# Altium schematic sheet MCU.SchDoc
size C; SheetNumber: 2; SheetTotal: 6
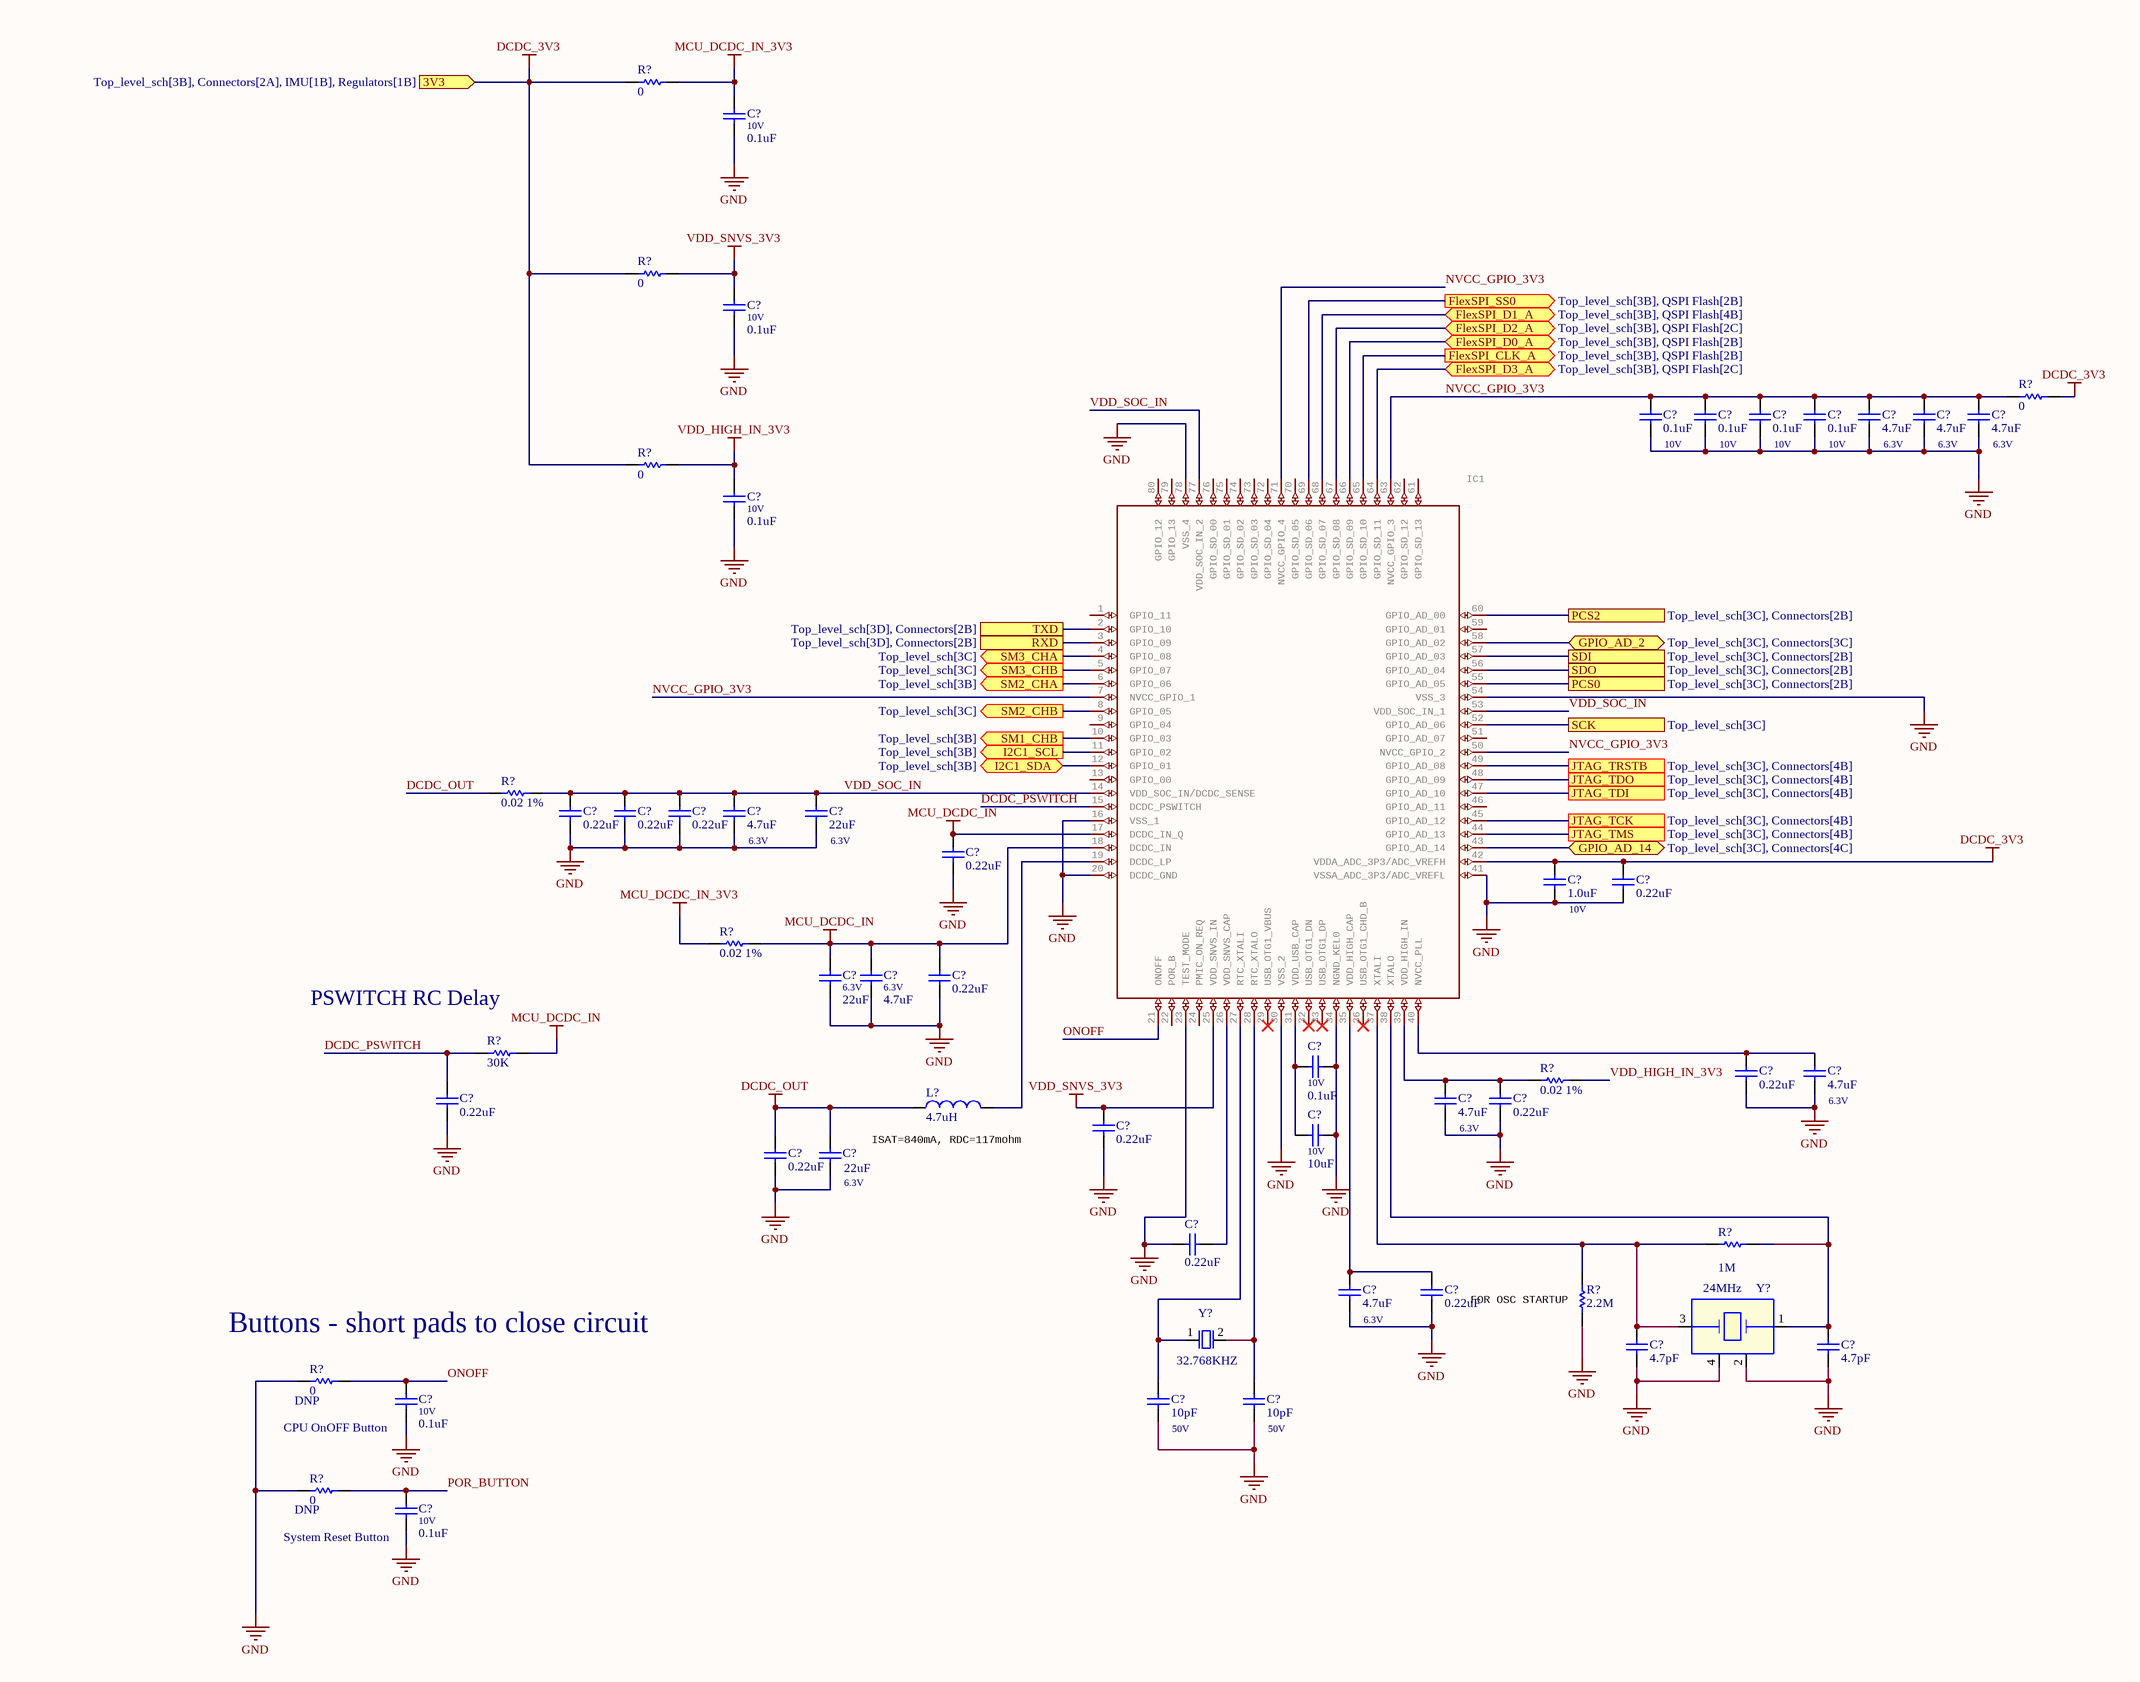
[diagram p0: MCU.SchDoc]

## Parts
(Parts that share a designator on the sheet are numbered #1, #2 ... from top to bottom, then left to right.)
C?#1  value 0.1uF  Voltage: 10V  (hidden comment: Capacitor)
C?#2  value 0.1uF  Voltage: 10V  (hidden comment: Capacitor)
C?#3  value 0.1uF  Voltage: 10V  (hidden comment: Capacitor)
C?#4  value 0.1uF  Voltage: 10V  (hidden comment: Capacitor)
C?#5  value 0.1uF  Voltage: 10V  (hidden comment: Capacitor)
C?#6  value 0.1uF  Voltage: 10V  (hidden comment: Capacitor)
C?#7  value 4.7uF  Voltage: 6.3V  (hidden comment: Capacitor)
C?#8  value 4.7uF  Voltage: 6.3V  (hidden comment: Capacitor)
C?#9  value 4.7uF  Voltage: 6.3V  (hidden comment: Capacitor)
C?#10  value 0.1uF  Voltage: 10V  (hidden comment: Capacitor)
C?#11  OC14: 0.22uF  (hidden comment: Capacitor)
C?#12  OC15: 0.22uF  (hidden comment: Capacitor)
C?#13  OC16: 0.22uF  (hidden comment: Capacitor)
C?#14  value 4.7uF  Voltage: 6.3V  (hidden comment: Capacitor)
C?#15  value 22uF  Voltage: 6.3V  (hidden comment: Capacitor)
C?#16  value 0.22uF  (hidden comment: Capacitor)
C?#17  value 1.0uF  Voltage: 10V  (hidden comment: Capacitor)
C?#18  OC7: 0.22uF  (hidden comment: Capacitor)
C?#19  value 22uF  Voltage: 6.3V  (hidden comment: Capacitor)
C?#20  value 4.7uF  Voltage: 6.3V  (hidden comment: Capacitor)
C?#21  value 0.22uF  (hidden comment: Capacitor)
C?#22  value 0.1uF  Voltage: 10V  (hidden comment: Capacitor)
C?#23  OC25: 0.22uF  (hidden comment: Capacitor)
C?#24  value 4.7uF  Voltage: 6.3V  (hidden comment: Capacitor)
C?#25  value 0.22uF  (hidden comment: Capacitor)
C?#26  value 4.7uF  Voltage: 6.3V  (hidden comment: Capacitor)
C?#27  OC20: 0.22uF  (hidden comment: Capacitor)
C?#28  value 10uF  Voltage: 10V  (hidden comment: Capacitor)
C?#29  value 0.22uF  (hidden comment: Capacitor)
C?#30  value 0.22uF  (hidden comment: Capacitor)
C?#31  value 22uF  Voltage: 6.3V  (hidden comment: Capacitor)
C?#32  OC24: 0.22uF  (hidden comment: Capacitor)
C?#33  value 4.7uF  Voltage: 6.3V  (hidden comment: Capacitor)
C?#34  OC22: 0.22uF  (hidden comment: Capacitor)
C?#35  OC16: 4.7pF  (hidden comment: Capacitor)
C?#36  OC16: 4.7pF  (hidden comment: Capacitor)
C?#37  value 0.1uF  Voltage: 10V  (hidden comment: Capacitor)
C?#38  value 10pF  Voltage: 50V  (hidden comment: Capacitor)
C?#39  value 10pF  Voltage: 50V  (hidden comment: Capacitor)
C?#40  value 0.1uF  Voltage: 10V  (hidden comment: Capacitor)
IC1  ARM Microcontrollers - MCU i.MX RT1010 Crossover MCU with Arm  Cortex -M7 core   Source:  Datasheet  [QFP50P1400X1400X160-80N]  (value not drawn)
L?  value 4.7uH  (hidden comment: Inductor)
R?#1  value 0  (hidden comment: Resistor)
R?#2  value 0  (hidden comment: Resistor)
R?#3  OR12: 0  (hidden comment: Resistor)
R?#4  value 0  (hidden comment: Resistor)
R?#5  OR13: 0.02 1%  (hidden comment: Resistor)
R?#6  value 0.02 1%  (hidden comment: Resistor)
R?#7  value 30K  (hidden comment: Resistor)
R?#8  OR14: 0.02 1%  (hidden comment: Resistor)
R?#9  value 1M  (hidden comment: Resistor)
R?#10  OR13: 2.2M  (hidden comment: Resistor)
R?#11  value 0  (hidden comment: Resistor)
R?#12  value 0  (hidden comment: Resistor)
Y?#1  24MHz  [xtl4_2p1x1p7mm_sm]
Y?#2  32.768KHZ  [XTAL2-3p2x1p5-SM]

## Ports
3V3 (in, see Top_level_sch[3B], Connectors[2A], IMU[1B], Regulators[1B]), FlexSPI_CLK_A (out, see Top_level_sch[3B], QSPI Flash[2B]), FlexSPI_D0_A (bidir, see Top_level_sch[3B], QSPI Flash[2B]), FlexSPI_D1_A (bidir, see Top_level_sch[3B], QSPI Flash[4B]), FlexSPI_D2_A (bidir, see Top_level_sch[3B], QSPI Flash[2C]), FlexSPI_D3_A (bidir, see Top_level_sch[3B], QSPI Flash[2C]), FlexSPI_SS0 (out, see Top_level_sch[3B], QSPI Flash[2B]), GPIO_AD_2 (bidir, see Top_level_sch[3C], Connectors[3C]), GPIO_AD_14 (bidir, see Top_level_sch[3C], Connectors[4C]), I2C1_SCL (out, see Top_level_sch[3B]), I2C1_SDA (bidir, see Top_level_sch[3B]), JTAG_TCK (see Top_level_sch[3C], Connectors[4B]), JTAG_TDI (see Top_level_sch[3C], Connectors[4B]), JTAG_TDO (see Top_level_sch[3C], Connectors[4B]), JTAG_TMS (see Top_level_sch[3C], Connectors[4B]), JTAG_TRSTB (see Top_level_sch[3C], Connectors[4B]), PCS0 (see Top_level_sch[3C], Connectors[2B]), PCS2 (see Top_level_sch[3C], Connectors[2B]), RXD (see Top_level_sch[3D], Connectors[2B]), SCK (see Top_level_sch[3C]), SDI (see Top_level_sch[3C], Connectors[2B]), SDO (see Top_level_sch[3C], Connectors[2B]), SM1_CHB (out, see Top_level_sch[3B]), SM2_CHA (out, see Top_level_sch[3B]), SM2_CHB (out, see Top_level_sch[3C]), SM3_CHA (out, see Top_level_sch[3C]), SM3_CHB (out, see Top_level_sch[3C]), TXD (see Top_level_sch[3D], Connectors[2B])

## Nets
DCDC_3V3: C?#17.2 C?#18.2 IC1.42(VDDA_ADC_3P3/ADC_VREFH) R?#1.1 R?#2.1 R?#3.2 R?#4.1 ; port 3V3
DCDC_OUT: C?#30.2 C?#31.2 L?.1 R?#5.1
GND: C?#1.2 C?#2.2 C?#3.1 C?#4.1 C?#5.1 C?#6.1 C?#7.1 C?#8.1 C?#9.1 C?#10.2 C?#11.1 C?#12.1 C?#13.1 C?#14.1 C?#15.1 C?#16.1 C?#17.1 C?#18.1 C?#19.1 C?#20.1 C?#21.1 C?#22.1 C?#23.1 C?#24.1 C?#25.1 C?#26.1 C?#27.1 C?#28.1 C?#29.1 C?#30.1 C?#31.1 C?#32.2 C?#33.1 C?#34.1 C?#35.1 C?#36.1 C?#37.2 C?#38.1 C?#39.1 C?#40.2 IC1.16(VSS_1) IC1.20(DCDC_GND) IC1.23(TEST_MODE) IC1.30(VSS_2) IC1.34(NGND_KEL0) IC1.41(VSSA_ADC_3P3/ADC_VREFL) IC1.54(VSS_3) IC1.78(VSS_4) R?#10.1 R?#11.1 R?#12.1 Y?#1.2 Y?#1.4
MCU_DCDC_IN: C?#16.2 C?#19.2 C?#20.2 C?#21.2 IC1.17(DCDC_IN_Q) IC1.18(DCDC_IN) R?#6.1 R?#7.1
MCU_DCDC_IN_3V3: C?#1.1 R?#1.2 R?#6.2
VDD_HIGH_IN_3V3: C?#10.1 R?#4.2 R?#8.2
VDD_SNVS_3V3: C?#2.1 C?#29.2 IC1.25(VDD_SNVS_IN) R?#2.2
DCDC_PSWITCH: C?#25.2 IC1.15(DCDC_PSWITCH) R?#7.2
FlexSPI_CLK_A: IC1.65(GPIO_SD_10) ; port FlexSPI_CLK_A
FlexSPI_D0_A: IC1.66(GPIO_SD_09) ; port FlexSPI_D0_A
FlexSPI_D1_A: IC1.68(GPIO_SD_07) ; port FlexSPI_D1_A
FlexSPI_D2_A: IC1.67(GPIO_SD_08) ; port FlexSPI_D2_A
FlexSPI_D3_A: IC1.64(GPIO_SD_11) ; port FlexSPI_D3_A
FlexSPI_SS0: IC1.69(GPIO_SD_06) ; port FlexSPI_SS0
GPIO_AD_2: IC1.58(GPIO_AD_02) ; port GPIO_AD_2
GPIO_AD_14: IC1.43(GPIO_AD_14) ; port GPIO_AD_14
I2C1_SCL: IC1.11(GPIO_02) ; port I2C1_SCL
I2C1_SDA: IC1.12(GPIO_01) ; port I2C1_SDA
JTAG_TCK: IC1.45(GPIO_AD_12) ; port JTAG_TCK
JTAG_TDI: IC1.47(GPIO_AD_10) ; port JTAG_TDI
JTAG_TDO: IC1.48(GPIO_AD_09) ; port JTAG_TDO
JTAG_TMS: IC1.44(GPIO_AD_13) ; port JTAG_TMS
JTAG_TRSTB: IC1.49(GPIO_AD_08) ; port JTAG_TRSTB
NVCC_GPIO_3V3: C?#3.2 C?#4.2 C?#5.2 C?#6.2 C?#7.2 C?#8.2 C?#9.2 IC1.7(NVCC_GPIO_1) IC1.50(NVCC_GPIO_2) IC1.63(NVCC_GPIO_3) IC1.71(NVCC_GPIO_4) R?#3.1
ONOFF: C?#37.1 IC1.21(ONOFF) R?#11.2
PCS0: IC1.55(GPIO_AD_05) ; port PCS0
PCS2: IC1.60(GPIO_AD_00) ; port PCS2
POR_BUTTON: C?#40.1 R?#12.2
RXD: IC1.3(GPIO_09) ; port RXD
SCK: IC1.52(GPIO_AD_06) ; port SCK
SDI: IC1.57(GPIO_AD_03) ; port SDI
SDO: IC1.56(GPIO_AD_04) ; port SDO
SM1_CHB: IC1.10(GPIO_03) ; port SM1_CHB
SM2_CHA: IC1.6(GPIO_06) ; port SM2_CHA
SM2_CHB: IC1.8(GPIO_05) ; port SM2_CHB
SM3_CHA: IC1.4(GPIO_08) ; port SM3_CHA
SM3_CHB: IC1.5(GPIO_07) ; port SM3_CHB
TXD: IC1.2(GPIO_10) ; port TXD
VDD_SOC_IN: C?#11.2 C?#12.2 C?#13.2 C?#14.2 C?#15.2 IC1.14(VDD_SOC_IN/DCDC_SENSE) IC1.53(VDD_SOC_IN_1) IC1.77(VDD_SOC_IN_2) R?#5.2
NetC?#22_2: C?#22.2 C?#28.2 IC1.31(VDD_USB_CAP)
NetC?#23_2: C?#23.2 C?#24.2 IC1.40(NVCC_PLL)
NetC?#26_2: C?#26.2 C?#27.2 IC1.39(VDD_HIGH_IN) R?#8.1
NetC?#32_1: C?#32.1 IC1.26(VDD_SNVS_CAP)
NetC?#33_2: C?#33.2 C?#34.2 IC1.35(VDD_HIGH_CAP)
NetC?#35_2: C?#35.2 IC1.37(XTALI) R?#9.1 R?#10.2 Y?#1.3
NetC?#36_2: C?#36.2 IC1.38(XTALO) R?#9.2 Y?#1.1
NetC?#38_2: C?#38.2 IC1.27(RTC_XTALI) Y?#2.1
NetC?#39_2: C?#39.2 IC1.28(RTC_XTALO) Y?#2.2
NetIC1_19: IC1.19(DCDC_LP) L?.2

Not connected (* = marked no-connect by the designer): IC1 1(GPIO_11) 9(GPIO_04) 13(GPIO_00) 22(POR_B) 24(PMIC_ON_REQ) 29(USB_OTG1_VBUS)* 32(USB_OTG1_DN)* 33(USB_OTG1_DP)* 36(USB_OTG1_CHD_B)* 46(GPIO_AD_11) 51(GPIO_AD_07) 59(GPIO_AD_01) 61(GPIO_SD_13) 62(GPIO_SD_12) 70(GPIO_SD_05) 72(GPIO_SD_04) 73(GPIO_SD_03) 74(GPIO_SD_02) 75(GPIO_SD_01) 76(GPIO_SD_00) 79(GPIO_13) 80(GPIO_12)

## Notes on the sheet
- (near R?#7) PSWITCH RC Delay
- ISAT=840mA, RDC=117mohm
- Buttons - short pads to close circuit
- FOR OSC STARTUP
- CPU OnOFF Button
- (near C?#40) System Reset Button

## Library data of the parts
C?#1-C?#40 = Capacitor: SimulationGenericComponent: True
IC1 = MIMXRT1011DAE5A: Manufacturer_Name: NXP; GateName_1: G$1; SymbolName_1: MIMXRT1011DAE5A; LibraryName: MIMXRT1011DAE5A; DeviceSetName: MIMXRT1011DAE5A; Package: QFP50P1400X1400X160-80N; Manufacturer_Part_Number: MIMXRT1011DAE5A; Mouser_Part_Number: 771-MIMXRT1011DAE5A; Mouser_Price-Stock: https://www.mouser.co.uk/ProductDetail/NXP-Semiconductors/MIMXRT1011DAE5A?qs=P1JMDcb91o5GoeF%252BJrcvqQ%3D%3D; Arrow_Part_Number: MIMXRT1011DAE5A; Arrow_Price-Stock: https://www.arrow.com/en/products/mimxrt1011dae5a/nxp-semiconductors; Height: 1.6mm
L? = Inductor: SimulationGenericComponent: True
R?#1-R?#4 R?#11 R?#12 = Resistor: SimulationGenericComponent: True; TC1: 0; TC2: 0
R?#5-R?#10 = Resistor: TC1: 0; SimulationGenericComponent: True; TC2: 0
Y?#1 = XTAL_13: XTAL 24MHZ -- 20PPM 2.0X1.6MM SMD; CLASS: IC; CAD_APPROVED: Yes; Temp_Range: -30C to 85C; MFG_PN01: XRCGB24M000F2P29R0; MFG_NAME01: MURATA; AGILE_PN: 230-78216; PCB Footprint: xtl4_2p1x1p7mm_sm; HEIGHT: 0.7MM; ROHS: Yes
Y?#2 = CRYSTAL: XTAL 32.768KHZ 7PF 20PPM -- SMT; CLASS: IC; AGILE_PN: 230-78102; MFG_NAME01: EPSON ELECTRONICS; MFG_PN01: FC-135 32.7680KA-AG3; CAD_APPROVED: Yes; PCB Footprint: XTAL2-3p2x1p5-SM; ROHS: Yes; HEIGHT: 0.9MM